# Altium schematic sheet 34_page21.SchDoc
size 381 x 241 mm; SheetNumber: 4; SheetTotal: 4
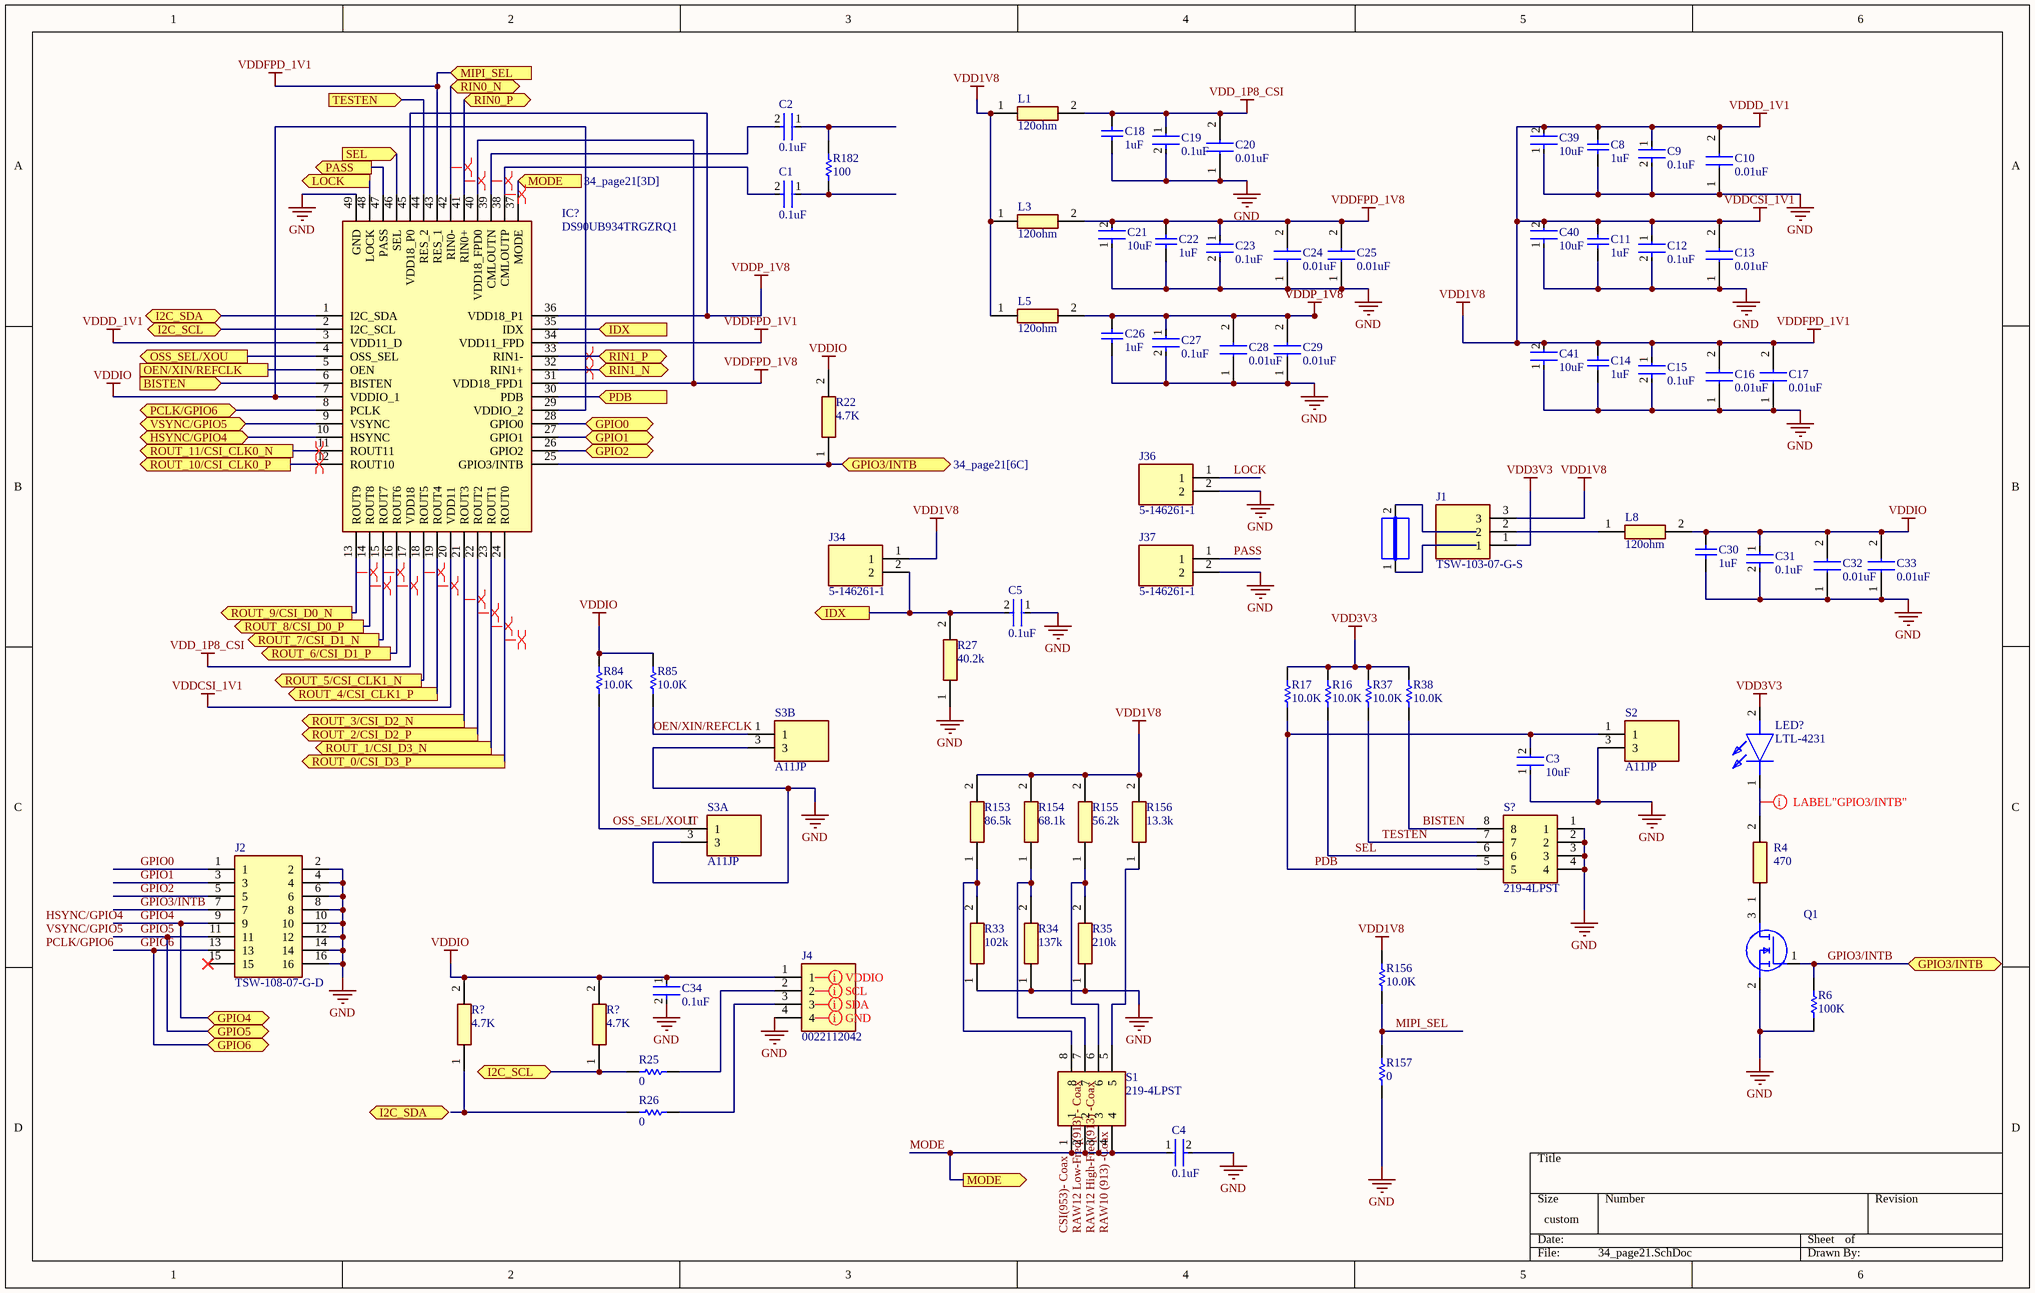
[diagram p0: 34_page21.SchDoc]

## Parts
(Parts that share a designator on the sheet are numbered #1, #2 ... from top to bottom, then left to right.)
?  JUMPER  [JUMPER]  (value not drawn)
C1  0.1uF  [FP-GRM15-MFG]
C2  0.1uF  [FP-GRM15-MFG]
C3  10uF  [FP-GRM21B-0_1-IPC_C]
C4  0.1uF  [FP-GRM15-MFG]
C5  0.1uF  [FP-GRM15-MFG]
C8  1uF  [CAPC1608X90X35ML10T15]
C9  0.1uF  [FP-GRM15-MFG]
C10  0.01uF  [CAPC1005X70N]
C11  1uF  [CAPC1608X90X35ML10T15]
C12  0.1uF  [FP-GRM15-MFG]
C13  0.01uF  [CAPC1005X70N]
C14  1uF  [CAPC1608X90X35ML10T15]
C15  0.1uF  [FP-GRM15-MFG]
C16  0.01uF  [CAPC1005X70N]
C17  0.01uF  [CAPC1005X70N]
C18  1uF  [CAPC1608X90X35ML10T15]
C19  0.1uF  [FP-GRM15-MFG]
C20  0.01uF  [CAPC1005X70N]
C21  10uF  [FP-GRM21B-0_1-IPC_C]
C22  1uF  [CAPC1608X90X35ML10T15]
C23  0.1uF  [FP-GRM15-MFG]
C24  0.01uF  [CAPC1005X70N]
C25  0.01uF  [CAPC1005X70N]
C26  1uF  [CAPC1608X90X35ML10T15]
C27  0.1uF  [FP-GRM15-MFG]
C28  0.01uF  [CAPC1005X70N]
C29  0.01uF  [CAPC1005X70N]
C30  1uF  [CAPC1608X90X35ML10T15]
C31  0.1uF  [FP-GRM15-MFG]
C32  0.01uF  [CAPC1005X70N]
C33  0.01uF  [CAPC1005X70N]
C34  0.1uF  [FP-GRM15-MFG]
C39  10uF  [FP-GRM21B-0_1-IPC_C]
C40  10uF  [FP-GRM21B-0_1-IPC_C]
C41  10uF  [FP-GRM21B-0_1-IPC_C]
IC?  DS90UB934TRGZRQ1  [QFN50P700X700X100-49N-D]
J1  TSW-103-07-G-S  [TSW-103-XX-YY-S]
J2  TSW-108-07-G-D  [HDRV16W64P254_2X8_2032X508X838P]
J4  0022112042  [HDRV4W87P0X254_1X4_1010X635X1105P]
J34  5-146261-1  [51462611]
J36  5-146261-1  [51462611]
J37  5-146261-1  [51462611]
L1  120ohm  [ERA3AEB101V]
L3  120ohm  [ERA3AEB101V]
L5  120ohm  [ERA3AEB101V]
L8  120ohm  [ERA3AEB101V]
LED?  LTL-4231  [LTL4231NHBP]
Q1  (no value)  [SOT96P240X115-3N]
R4  470  [ERA2AED122X]
R6  100K  [RESC1608X55X30ML15T15]
R16  10.0K  [RESC1005X40X25ML05T05]
R17  10.0K  [RESC1005X40X25ML05T05]
R22  4.7K  [ERJ2RKD1004X]
R25  0  [RESC1005X40X25LL05T05]
R26  0  [RESC1005X40X25LL05T05]
R27  40.2k  [ERA2AED122X]
R33  102k  [ERJ2RKD1004X]
R34  137k  [RESC1608X55N]
R35  210k  [ERJ2RKD1004X]
R37  10.0K  [RESC1005X40X25ML05T05]
R38  10.0K  [RESC1005X40X25ML05T05]
R84  10.0K  [RESC1005X40X25ML05T05]
R85  10.0K  [RESC1005X40X25ML05T05]
R153  86.5k  [ERJ2RKD1004X]
R154  68.1k  [ERJ1GN_(0201)]
R155  56.2k  [CRCW0402200KFKED]
R156#1  13.3k  [ERJ2RKD1004X]
R156#2  10.0K  [RESC1005X40X25ML05T05]
R157  0  [RESC1005X40X25LL05T05]
R182  100  [RESC1005X40X25LL05T05]
R?#1  4.7K  [ERJ2RKD1004X]
R?#2  4.7K  [ERJ2RKD1004X]
S1  219-4LPST  [219-4LPST]
S2  A11JP  [A11JP]
S3A  A11JP  [A11JP]
S3B  A11JP  [A11JP]
S?  219-4LPST  [219-4LPST]

## Ports
BISTEN (in), GPIO0 (bidir), GPIO1 (bidir), GPIO2 (bidir), GPIO3/INTB (bidir, see 34_page21[3B]), GPIO3/INTB (bidir, see 34_page21[6C]), GPIO4 (bidir), GPIO5 (bidir), GPIO6 (bidir), HSYNC/GPIO4 (bidir), I2C_SCL (bidir, see 34_page21[1B]), I2C_SCL (bidir, see 34_page21[2D]), I2C_SDA (bidir, see 34_page21[1A]), I2C_SDA (bidir, see 34_page21[2D]), IDX (in, see 34_page21[3B]), IDX (out, see 34_page21[2B]), LOCK (out), MIPI_SEL (in), MODE (in, see 34_page21[3D]), MODE (out, see 34_page21[2A]), OEN/XIN/REFCLK, OSS_SEL/XOU (out), PASS (out), PCLK/GPIO6 (bidir), PDB (in), RIN0_N (bidir), RIN0_P (bidir), RIN1_N (bidir), RIN1_P (bidir), ROUT_0/CSI_D3_P (out), ROUT_1/CSI_D3_N (out), ROUT_2/CSI_D2_P (out), ROUT_3/CSI_D2_N (out), ROUT_4/CSI_CLK1_P (out), ROUT_5/CSI_CLK1_N (out), ROUT_6/CSI_D1_P (out), ROUT_7/CSI_D1_N (out), ROUT_8/CSI_D0_P (out), ROUT_9/CSI_D0_N (out), ROUT_10/CSI_CLK0_P (out), ROUT_11/CSI_CLK0_N (out), SEL (in), TESTEN (in), VSYNC/GPIO5 (bidir)

## Nets
GND: C3.1 C4.2 C5.1 C8.1 C9.2 C10.1 C11.1 C12.2 C13.1 C14.1 C15.2 C16.1 C17.1 C18.1 C19.2 C20.1 C21.1 C22.1 C23.2 C24.1 C25.1 C26.1 C27.2 C28.1 C29.1 C30.1 C31.2 C32.1 C33.1 C34.2 C39.1 C40.1 C41.1 IC?.49(GND) J2.2 J2.4 J2.6 J2.8 J2.10 J2.12 J2.14 J2.16 J4.4 J36.2 J37.2 Q1.2(S) R6.1 R27.1 R33.1 R34.1 R35.1 R157.1 S2.3 S3A.3 S3B.3 S?.1 S?.2 S?.3 S?.4
VDD1V8: C8.2 C9.1 C10.2 C11.2 C12.1 C13.2 C14.2 C15.1 C16.2 C17.2 C39.2 C40.2 C41.2 IC?.3(VDD11_D) IC?.20(VDD11) IC?.34(VDD11_FPD) IC?.43(RES_1) J1.3 J34.1 L1.1 L3.1 L5.1 R153.2 R154.2 R155.2 R156#1.2 R156#2.1 ; port MIPI_SEL  [also labelled VDDCSI_1V1, VDDD_1V1, VDDFPD_1V1]
VDD3V3: J1.1 LED?.2(A) R16.1 R17.1 R37.1 R38.1
VDD_1P8_CSI: C18.2 C19.1 C20.2 IC?.17(VDD18) L1.2
VDDFPD_1V8: C21.2 C22.2 C23.1 C24.2 C25.2 IC?.31(VDD18_FPD1) IC?.40(VDD18_FPD0) L3.2
VDDIO: C30.2 C31.1 C32.2 C33.2 C34.1 IC?.7(VDDIO_1) IC?.29(VDDIO_2) J4.1 L8.2 R22.2 R84.1 R85.1 R?#1.2 R?#2.2
VDDP_1V8: C26.2 C27.1 C28.2 C29.2 IC?.36(VDD18_P1) IC?.45(VDD18_P0) L5.2
BISTEN: IC?.6(BISTEN) ; port BISTEN
BISTEN: R38.2 S?.8  [a separate net that carries the same name]
GPIO0: IC?.28(GPIO0) ; port GPIO0
GPIO0: J2.1  [a separate net that carries the same name]
GPIO1: IC?.27(GPIO1) ; port GPIO1
GPIO1: J2.3  [a separate net that carries the same name]
GPIO2: IC?.26(GPIO2) ; port GPIO2
GPIO2: J2.5  [a separate net that carries the same name]
GPIO3/INTB: IC?.25(GPIO3/INTB) J2.7 Q1.1(G) R6.2 R22.1 ; port GPIO3/INTB
GPIO4: J2.9 ; port GPIO4
GPIO5: J2.11 ; port GPIO5
GPIO6: J2.13 ; port GPIO6
HSYNC/GPIO4: IC?.10(HSYNC) ; port HSYNC/GPIO4
I2C_SCL: IC?.2(I2C_SCL) R25.1 R?#2.1 ; port I2C_SCL
I2C_SDA: IC?.1(I2C_SDA) ; port I2C_SDA
IDX: C5.2 IC?.35(IDX) J34.2 R27.2 ; port IDX
LOCK: IC?.48(LOCK) ; port LOCK
LOCK: J36.1  [a separate net that carries the same name]
MIPI_SEL: R156#2.2 R157.2
MODE: C4.1 IC?.37(MODE) S1.1 S1.2 S1.3 S1.4 ; port MODE
OEN/XIN/REFCLK: IC?.5(OEN) ; port OEN/XIN/REFCLK
OEN/XIN/REFCLK: R85.2 S3B.1  [a separate net that carries the same name]
OSS_SEL/XOU: IC?.4(OSS_SEL) ; port OSS_SEL/XOU
OSS_SEL/XOUT: R84.2 S3A.1
PASS: IC?.47(PASS) ; port PASS
PASS: J37.1  [a separate net that carries the same name]
PCLK/GPIO6: IC?.8(PCLK) ; port PCLK/GPIO6
PDB: IC?.30(PDB) ; port PDB
PDB: C3.2 R17.2 S2.1 S?.5  [a separate net that carries the same name]
RIN0_N: IC?.42(RIN0-) ; port RIN0_N
RIN0_P: IC?.41(RIN0+) ; port RIN0_P
RIN1_N: IC?.32(RIN1+) ; port RIN1_N
RIN1_P: IC?.33(RIN1-) ; port RIN1_P
ROUT_0/CSI_D3_P: IC?.24(ROUT0) ; port ROUT_0/CSI_D3_P
ROUT_1/CSI_D3_N: IC?.23(ROUT1) ; port ROUT_1/CSI_D3_N
ROUT_2/CSI_D2_P: IC?.22(ROUT2) ; port ROUT_2/CSI_D2_P
ROUT_3/CSI_D2_N: IC?.21(ROUT3) ; port ROUT_3/CSI_D2_N
ROUT_4/CSI_CLK1_P: IC?.19(ROUT4) ; port ROUT_4/CSI_CLK1_P
ROUT_5/CSI_CLK1_N: IC?.18(ROUT5) ; port ROUT_5/CSI_CLK1_N
ROUT_6/CSI_D1_P: IC?.16(ROUT6) ; port ROUT_6/CSI_D1_P
ROUT_7/CSI_D1_N: IC?.15(ROUT7) ; port ROUT_7/CSI_D1_N
ROUT_8/CSI_D0_P: IC?.14(ROUT8) ; port ROUT_8/CSI_D0_P
ROUT_9/CSI_D0_N: IC?.13(ROUT9) ; port ROUT_9/CSI_D0_N
ROUT_10/CSI_CLK0_P: IC?.12(ROUT10) ; port ROUT_10/CSI_CLK0_P
ROUT_11/CSI_CLK0_N: IC?.11(ROUT11) ; port ROUT_11/CSI_CLK0_N
SEL: IC?.46(SEL) ; port SEL
SEL: R16.2 S?.6  [a separate net that carries the same name]
TESTEN: IC?.44(RES_2) ; port TESTEN
TESTEN: R37.2 S?.7  [a separate net that carries the same name]
VSYNC/GPIO5: IC?.9(VSYNC) ; port VSYNC/GPIO5
NetC1_1: C1.1 R182.1
NetC1_2: C1.2 IC?.38(CMLOUTP)
NetC2_1: C2.1 R182.2
NetC2_2: C2.2 IC?.39(CMLOUTN)
NetJ1_2: J1.2 L8.1
NetJ4_2: J4.2 R25.2
NetJ4_3: J4.3 R26.2
NetLED?_1: LED?.1(K) R4.2
NetQ1_3: Q1.3(D) R4.1
NetR26_1: R26.1 R?#1.1
NetR33_2: R33.2 R153.1 S1.8
NetR34_2: R34.2 R154.1 S1.7
NetR35_2: R35.2 R155.1 S1.6
NetR156#1_1: R156#1.1 S1.5

Not connected (* = marked no-connect by the designer): ? 1 2; J2 15*

## Layout directives
mark named VDDIO: (no net found under the mark)
mark named SCL: (no net found under the mark)
mark named SDA: (no net found under the mark)
mark named GND: (no net found under the mark)
differential pair: NetC1_2, NetC2_2, RIN0_N, RIN0_P, RIN1_N, RIN1_P, ROUT_0/CSI_D3_P, ROUT_1/CSI_D3_N, ROUT_2/CSI_D2_P, ROUT_3/CSI_D2_N, ROUT_4/CSI_CLK1_P, ROUT_5/CSI_CLK1_N, ROUT_6/CSI_D1_P, ROUT_7/CSI_D1_N, ROUT_8/CSI_D0_P, ROUT_9/CSI_D0_N, ROUT_10/CSI_CLK0_P, ROUT_11/CSI_CLK0_N
mark named LABEL"GPIO3/INTB": NetLED?_1

## Notes on the sheet
- Labels drawn without touching a wire or pin: CSI(953)- Coax, HSYNC/GPIO4, PCLK/GPIO6, RAW10 (913) -Coax, RAW12 High-Freq(913) -Coax, RAW12 Low-Freq(913) - Coax, VSYNC/GPIO5

## Library data of the parts
? = CMP-009-00061-2: Pins: 2
C1 C2 C4 C5 C9 C12 C15 C19 C23 C27 C31 C34 = CMP-2100-03641-2: CAP CER 0.1UF 16V X7R 0402; Manufacturer Part Number: GRM155R71C104KA88D; Manufacturer: Murata; Standoff Height: 0mm; Tolerance: 10%; Voltage Rating: 16Vdc; Material: Ceramic; Capacitance: 0.10μF; Value: 0.10μF; RoHS: TRUE; Temperature Characteristic: X7R; Octopart: https://octopart.com/grm155r71c104ka88d-murata-196880; Digikey Description: CAP CER 0.1UF 16V X7R 0402; Device Class L3: Ceramic Capacitors; Height: 0.55mm; ComponentLink2Description: Datasheet; Temperature Range Low: -55°C; Ipc Land Pattern Name: CAPC10050X219; ComponentLink2URL: https://search.murata.co.jp/Ceramy/image/img/A01X/G101/ENG/GRM155R71H471KA01-01A.pdf; Device Class L1: Passive Components; Lead Free: yes; Category: Cap; Package: GRM15; Temperature: -55°C to +125°C; Device Class L2: Capacitors; Temperature Range High: +125°C; Mouser Description: 0402 0.1 uF 16V ±10 % Tolerance X7R SMT Multilayer Ceramic Capacitor
C3 C21 C39-C41 = CMP-2007-03453-2: Chip Multilayer Ceramic Capacitors for General Purpose, 0805, 10uF, X5R, 15%, 10%, 16V; Radiation Hardening: No; Thickness: 0.053inch; Voltage Rating (DC): 16V; Lead Free: Lead Free; Package Quantity: 1; Width: 1.25mm; Case Code (Imperial): 0805; Depth: 1.25mm; Packaging: Tape and Reel; Dielectric: X5R; Max Operating Temperature: 85°C; Tolerance: 10%; Voltage Rating: 16V; Voltage: 16V; Capacitance: 10uF; Height: 1.25mm; Case Code (Metric): 2012; Material: Ceramic; Mount: Surface Mount; Case/Package: 0805; REACH SVHC: No SVHC; Length: 2mm; Min Operating Temperature: -55°C; Termination: SMD/SMT
C8 C11 C14 C18 C22 C26 C30 = CMP-2006-02460-1: Manufacturer: Murata; Part Number: GRM188R71E105KA12D
C10 C13 C16 C17 C20 C24 C25 C28 C29 C32 C33 = GRM155R71C103KA01D: Capacitor; Manufacturer_Name: Murata Electronics; Datasheet Link: https://search.murata.co.jp/Ceramy/image/img/A01X/G101/ENG/GRM155R71C103KA01-01A.pdf; Height: 0.7mm; Manufacturer_Part_Number: GRM155R71C103KA01D; Mouser Part Number: 81-GRM36X103K16; Mouser Price/Stock: https://www.mouser.co.uk/ProductDetail/Murata-Electronics/GRM155R71C103KA01D?qs=8YPuuxuUzMI%252B9QLnzeLwhQ%3D%3D; Arrow Part Number: GRM155R71C103KA01D; Arrow Price/Stock: https://www.arrow.com/en/products/grm155r71c103ka01d/murata-manufacturing?utm_currency=USD&region=nac
IC? = DS90UB934TRGZRQ1: Integrated Circuit; Manufacturer_Name: Texas Instruments; Datasheet Link: https://www.ti.com/lit/ds/symlink/ds90ub934-q1.pdf?ts=1629015788533&ref_url=https%253A%252F%252Fwww.ti.com%252Fproduct%252FDS90UB934-Q1; Height: 1mm; Manufacturer_Part_Number: DS90UB934TRGZRQ1; Mouser Part Number: 595-DS90UB934TRGZRQ1; Mouser Price/Stock: https://www.mouser.co.uk/ProductDetail/Texas-Instruments/DS90UB934TRGZRQ1?qs=OEYMhS7p3Ya%2FTmvzDAxPyg%3D%3D; Arrow Part Number: DS90UB934TRGZRQ1; Arrow Price/Stock: https://www.arrow.com/en/products/ds90ub934trgzrq1/texas-instruments
J1 = TSW-103-07-G-S: Connector; Manufacturer_Name: SAMTEC; Datasheet Link: http://suddendocs.samtec.com/prints/tsw-xxx-xx-xxx-x-xx-xxx-mkt.pdf; Manufacturer_Part_Number: TSW-103-07-G-S; Mouser Part Number: 200-TSW10307GS; Mouser Price/Stock: https://www.mouser.co.uk/ProductDetail/Samtec/TSW-103-07-G-S?qs=iT52DjcXudtntd1jApTIAw%3D%3D; Arrow Part Number: TSW-103-07-G-S; Arrow Price/Stock: https://www.arrow.com/en/products/tsw-103-07-g-s/samtec?utm_currency=USD&region=europe
J2 = TSW-108-07-G-D: Connector; Manufacturer_Name: SAMTEC; Datasheet Link: https://suddendocs.samtec.com/catalog_english/tsw_th.pdf?_gl=1*vxrzbc*_ga*MTk4NDk3MDkyNi4xNjgxOTY2Mjg5*_ga_3KFNZC07WW*MTY4MzYyNDMyNC4zLjEuMTY4MzYyNDM4NC42MC4wLjA.; Height: 8.38mm; Manufacturer_Part_Number: TSW-108-07-G-D; Mouser Part Number: 200-TSW10807GD; Mouser Price/Stock: https://www.mouser.co.uk/ProductDetail/Samtec/TSW-108-07-G-D?qs=jyzYFa4oMQg0kuHhXNXiwg%3D%3D; Arrow Part Number: TSW-108-07-G-D; Arrow Price/Stock: https://www.arrow.com/en/products/tsw-108-07-g-d/samtec?region=nac
J4 = 0022112042: Connector; Manufacturer_Name: Molex; Datasheet Link: https://www.molex.com/en-us/products/part-detail-pdf/22112042?display=pdf; Height: 11.05mm; Manufacturer_Part_Number: 0022112042; Mouser Part Number: N/A; Mouser Price/Stock: https://www.mouser.co.uk/ProductDetail/Molex/0022112042?qs=PBcRNPEHKsrrJIg%2Fef6DRg%3D%3D; Arrow Part Number: 0022112042; Arrow Price/Stock: https://www.arrow.com/en/products/0022112042/molex
J34 J36 J37 = 5-146261-1: Connector; Manufacturer_Name: TE Connectivity; Datasheet Link: https://www.te.com/commerce/DocumentDelivery/DDEController?Action=showdoc&DocId=Customer+Drawing%7F146261%7FH1%7Fpdf%7FEnglish%7FENG_CD_146261_H1.pdf%7F5-146261-1; Height: 8.21mm; Manufacturer_Part_Number: 5-146261-1; Mouser Part Number: 571-5-146261-1; Mouser Price/Stock: https://www.mouser.co.uk/ProductDetail/TE-Connectivity/5-146261-1?qs=jDDLxflrbZ%252BgSNpf8BUwZg%3D%3D; Arrow Part Number: 5-146261-1; Arrow Price/Stock: https://www.arrow.com/en/products/5-146261-1/te-connectivity?region=nac
L1 L3 L5 L8 = ERA-3AEB121V: Resistor; Manufacturer_Name: Panasonic; Datasheet Link: https://industrial.panasonic.com/cdbs/www-data/pdf/RDM0000/AOA0000C307.pdf; Height: 0.55mm; Manufacturer_Part_Number: ERA-3AEB121V; Mouser Part Number: 667-ERA-3AEB121V; Mouser Price/Stock: https://www.mouser.co.uk/ProductDetail/Panasonic/ERA-3AEB121V?qs=nho8PGNfA6p7qyQ5b8td6g%3D%3D; Arrow Part Number: ERA-3AEB121V; Arrow Price/Stock: https://www.arrow.com/en/products/era-3aeb121v/panasonic?utm_currency=USD&region=europe
LED? = LTL-4231: LED; Manufacturer_Name: Lite-On; Datasheet Link: https://componentsearchengine.com/Datasheets/1/LTL-4231NHBP.pdf; Height: 7.55mm; Manufacturer_Part_Number: LTL-4231; Mouser Part Number: 859-LTL-4231; Mouser Price/Stock: https://www.mouser.co.uk/ProductDetail/Lite-On/LTL-4231?qs=ijkchSGtXvugYEuZKOTKWw%3D%3D; Arrow Part Number: LTL-4231; Arrow Price/Stock: https://www.arrow.com/en/products/ltl-4231/lite-on-technology?region=nac
Q1 = BSS138-7-F: MOSFET (N-Channel); Manufacturer_Name: Diodes Incorporated; Datasheet Link: https://www.diodes.com/assets/Datasheets/BSS138.pdf; Height: 1.15mm; Manufacturer_Part_Number: BSS138-7-F; Mouser Part Number: 621-BSS138-7-F; Mouser Price/Stock: https://www.mouser.co.uk/ProductDetail/Diodes-Incorporated/BSS138-7-F?qs=TJSU9qitBVRAP5gIAnNy0g%3D%3D; Arrow Part Number: BSS138-7-F; Arrow Price/Stock: https://www.arrow.com/en/products/bss138-7-f/diodes-incorporated?utm_currency=USD&region=europe
R4 = ERA-2AEB471X: Resistor; Manufacturer_Name: Panasonic; Datasheet Link: http://industrial.panasonic.com/cdbs/www-data/pdf/RDM0000/AOA0000C307.pdf; Height: 0.4mm; Manufacturer_Part_Number: ERA-2AEB471X; Mouser Part Number: 667-ERA-2AEB471X; Mouser Price/Stock: https://www.mouser.co.uk/ProductDetail/Panasonic/ERA-2AEB471X?qs=YFwoyZoVY0jPopG9TPwi5g%3D%3D
R6 = CMP-2000-00182-1: Part Number: ERJ-3EKF1003V; Manufacturer: Panasonic
R16 R17 R37 R38 R84 R85 R156#2 = CMP-2002-00433-1: Part Number: ERJ-2GEJ103X; Manufacturer: Panasonic
R22 R?#1 R?#2 = ERJ-2RKF4701X: Resistor; Manufacturer_Name: Panasonic; Datasheet Link: https://industrial.panasonic.com/cdbs/www-data/pdf/RDA0000/AOA0000C86.pdf; Height: 0.4mm; Manufacturer_Part_Number: ERJ-2RKF4701X; Mouser Part Number: 667-ERJ-2RKF4701X; Mouser Price/Stock: https://www.mouser.co.uk/ProductDetail/Panasonic/ERJ-2RKF4701X?qs=H7k1u0Mp9JQWpspavPhQZA%3D%3D; Arrow Part Number: ERJ-2RKF4701X; Arrow Price/Stock: https://www.arrow.com/en/products/erj-2rkf4701x/panasonic
R25 R26 R157 = CMP-2000-07451-1: Chip Resistor, 0 Ohm, 0.1 W, -55 to 155 degC, 0402 (1005 Metric), RoHS, Tape and Reel; Manufacturer: Panasonic; Voltage Rating (DC): 50V; Temperature Coefficient: 600ppm/��C; Max Power Dissipation: 100mW; Resistance: 0mOhm; Tolerance: 5%; Number of Terminations: 2; Mount: SurfaceMount; Height: 0.35mm; Packaging: TapeandReel; Contact Plating: Tin; Manufacturer URL: http://www.panasonic.com/; Composition: ThickFilm; Max Operating Temperature: 155degC; REACH SVHC: NoSVHC; Case/Package: 0402; Package Reference: 402; Depth: 0.5mm; Package Description: 2-Pin Surface Mount Device, Body 1 x 0.5 mm; Datasheet URL: https://industrial.panasonic.com/cdbs/www-data/pdf/RDA0000/AOA0000C301.pdf; RoHSCompliant: True; Case Code (Imperial): 0402; Military Standard: Not; Min Operating Temperature: -55degC; Power Rating: 100mW; Datasheet Version: 03/2015; Length: 1mm; Case Code (Metric): 1005; Termination: SMD/SMT; Mounting Technology: SurfaceMount; Voltage Rating: 50V; Width: 0.02inch; Package Quantity: 1; Lead Free: LeadFree; Radiation Hardening: No
R27 = ERA-2AEB4022X: Resistor; Manufacturer_Name: Panasonic; Datasheet Link: http://industrial.panasonic.com/cdbs/www-data/pdf/RDM0000/AOA0000C307.pdf; Height: 0.4mm; Manufacturer_Part_Number: ERA-2AEB4022X; Mouser Part Number: 667-ERA-2AEB4022X; Mouser Price/Stock: https://www.mouser.co.uk/ProductDetail/Panasonic/ERA-2AEB4022X?qs=nuXzIS8loXH10Z3ykLDV%252Bw%3D%3D
R33 = ERJ-2RKF1023X: Resistor; Manufacturer_Name: Panasonic; Datasheet Link: https://industrial.panasonic.com/cdbs/www-data/pdf/RDA0000/AOA0000C86.pdf; Height: 0.4mm; Manufacturer_Part_Number: ERJ-2RKF1023X; Mouser Part Number: 667-ERJ-2RKF1023X; Mouser Price/Stock: https://www.mouser.co.uk/ProductDetail/Panasonic/ERJ-2RKF1023X?qs=MVjVSMjNRMq%252BxWw2qC%252BI7Q%3D%3D; Arrow Part Number: ERJ-2RKF1023X; Arrow Price/Stock: https://www.arrow.com/en/products/erj-2rkf1023x/panasonic?utm_currency=USD&region=nac
R34 = ERJ-3EKF1373V: Resistor; Manufacturer_Name: Panasonic; Datasheet Link: http://industrial.panasonic.com/cdbs/www-data/pdf/RDA0000/AOA0000C86.pdf; Height: 0.55mm; Manufacturer_Part_Number: ERJ-3EKF1373V; Mouser Part Number: 667-ERJ-3EKF1373V; Mouser Price/Stock: https://www.mouser.com/Search/Refine.aspx?Keyword=667-ERJ-3EKF1373V; Arrow Part Number: ERJ-3EKF1373V; Arrow Price/Stock: https://www.arrow.com/en/products/erj-3ekf1373v/panasonic
R35 = ERJ-2RKF2103X: Resistor; Manufacturer_Name: Panasonic; Datasheet Link: https://industrial.panasonic.com/cdbs/www-data/pdf/RDA0000/AOA0000C86.pdf; Height: 0.4mm; Manufacturer_Part_Number: ERJ-2RKF2103X; Mouser Part Number: 667-ERJ-2RKF2103X; Mouser Price/Stock: https://www.mouser.co.uk/ProductDetail/Panasonic/ERJ-2RKF2103X?qs=YMBIwoNQYdXALfcmOcIIww%3D%3D; Arrow Part Number: ERJ-2RKF2103X; Arrow Price/Stock: https://www.arrow.com/en/products/erj-2rkf2103x/panasonic?region=nac
R153 = ERJ-2RKF8252X: Resistor; Manufacturer_Name: Panasonic; Datasheet Link: https://industrial.panasonic.com/cdbs/www-data/pdf/RDA0000/AOA0000C86.pdf; Height: 0.4mm; Manufacturer_Part_Number: ERJ-2RKF8252X; Mouser Part Number: 667-ERJ-2RKF8252X; Mouser Price/Stock: https://www.mouser.co.uk/ProductDetail/Panasonic/ERJ-2RKF8252X?qs=iBwFsHVUAOeDJg08SyLiGQ%3D%3D; Arrow Part Number: ERJ-2RKF8252X; Arrow Price/Stock: https://www.arrow.com/en/products/erj-2rkf8252x/panasonic?region=nac
R154 = ERJ-1GNF6812C: Resistor; Manufacturer_Name: Panasonic; Datasheet Link: https://industrial.panasonic.com/cdbs/www-data/pdf/RDA0000/AOA0000C301.pdf; Height: 0.26mm; Manufacturer_Part_Number: ERJ-1GNF6812C
R155 = CRCW040256K2FKED: Resistor; Manufacturer_Name: Vishay; Datasheet Link: http://www.vishay.com/docs/20035/dcrcwe3.pdf; Height: 0.4mm; Manufacturer_Part_Number: CRCW040256K2FKED; Mouser Part Number: 71-CRCW0402-56.2K-E3; Mouser Price/Stock: https://www.mouser.co.uk/ProductDetail/Vishay-Dale/CRCW040256K2FKED?qs=hAuyw6LW%252BLigEm20tMLrFQ%3D%3D; Arrow Part Number: CRCW040256K2FKED; Arrow Price/Stock: https://www.arrow.com/en/products/crcw040256k2fked/vishay
R156#1 = ERJ-2RKF1332X: Resistor; Manufacturer_Name: Panasonic; Datasheet Link: https://industrial.panasonic.com/cdbs/www-data/pdf/RDA0000/AOA0000C86.pdf; Height: 0.4mm; Manufacturer_Part_Number: ERJ-2RKF1332X; Mouser Part Number: 667-ERJ-2RKF1332X; Mouser Price/Stock: https://www.mouser.com/Search/Refine.aspx?Keyword=667-ERJ-2RKF1332X; Arrow Part Number: ERJ-2RKF1332X; Arrow Price/Stock: https://www.arrow.com/en/products/erj-2rkf1332x/panasonic?utm_currency=USD&region=nac
R182 = CMP-2002-00605-3: Chip Resistor, 100 Ohm, +/- 1%, 100 mW, -55 to 155 degC, 0402 (1005 Metric), RoHS, Tape and Reel; Manufacturer: Basic Passives; PartNumber: ERJ-2RKF1000X; Power Rating: 100 mW; Resistance: 100 Ohm; Voltage Rating: 50 V; Case\/Package: 0402; Width: 0.5 mm; Pins: 2; ComponentLink2Description: Datasheet; PackageReference: 0402; Height: 0.35 mm; Tolerance: 1%; DatasheetVersion: 04/2015; Case Code (Imperial): 0402; Min Operating Temperature: -55 degC; Radiation Hardening: No; Length: 1 mm; Package Quantity: 10000; PackageDescription: 2-Pin Surface Mount Device, Body 1 x 0.5 mm; Mounting Technology: Surface Mount; Case Code (Metric): 1005; Packaging: Tape and Reel; ComponentLink1URL: http://www.panasonic.com/; RoHSCompliant: true; Max Operating Temperature: 155 degC; REACH SVHC: Yes; ComponentLink1Description: Manufacturer URL; ComponentLink2URL: http://industrial.panasonic.com/cdbs/www-data/pdf/RDA0000/AOA0000C86.pdf; Mount: Surface Mount
S1 S? = 219-4LPST: Switch; Manufacturer_Name: CTS; Datasheet Link: https://www.ctscorp.com/Files/DataSheets/Switches/DIP-Switches/CTS-Switches-DIP-219-Series-Datasheet.pdf; Manufacturer_Part_Number: 219-4LPST; Mouser Part Number: 774-2194LPST; Mouser Price/Stock: https://www.mouser.co.uk/ProductDetail/CTS-Electronic-Components/219-4LPST?qs=qNzHFtQhdJ%252BX5DxjUF%252BqAA%3D%3D; Arrow Part Number: 219-4LPST; Arrow Price/Stock: https://www.arrow.com/en/products/219-4lpst/cts
S2 S3A S3B = A11JP: Switch; Manufacturer_Name: NKK Switches; Datasheet Link: https://www.mouser.co.uk/datasheet/2/295/Atoggles-19525.pdf; Height: 23.1mm; Manufacturer_Part_Number: A11JP; Mouser Part Number: 633-A11JP; Mouser Price/Stock: https://www.mouser.co.uk/ProductDetail/NKK-Switches/A11JP?qs=KqcCwYXy5KGYGAOWVYZnow%3D%3D; Arrow Part Number: A11JP; Arrow Price/Stock: https://www.arrow.com/en/products/a11jp/nkk-switches?utm_currency=USD&region=nac